# EasyEDA schematic rapoukChargingPCBv0.json
TITLE: rapoukChargingBoardv0; REV: 1.0; Date: 09-01-25; Sheet: 1/1; Drawn By: Roman Suk; Company: Suk Industries
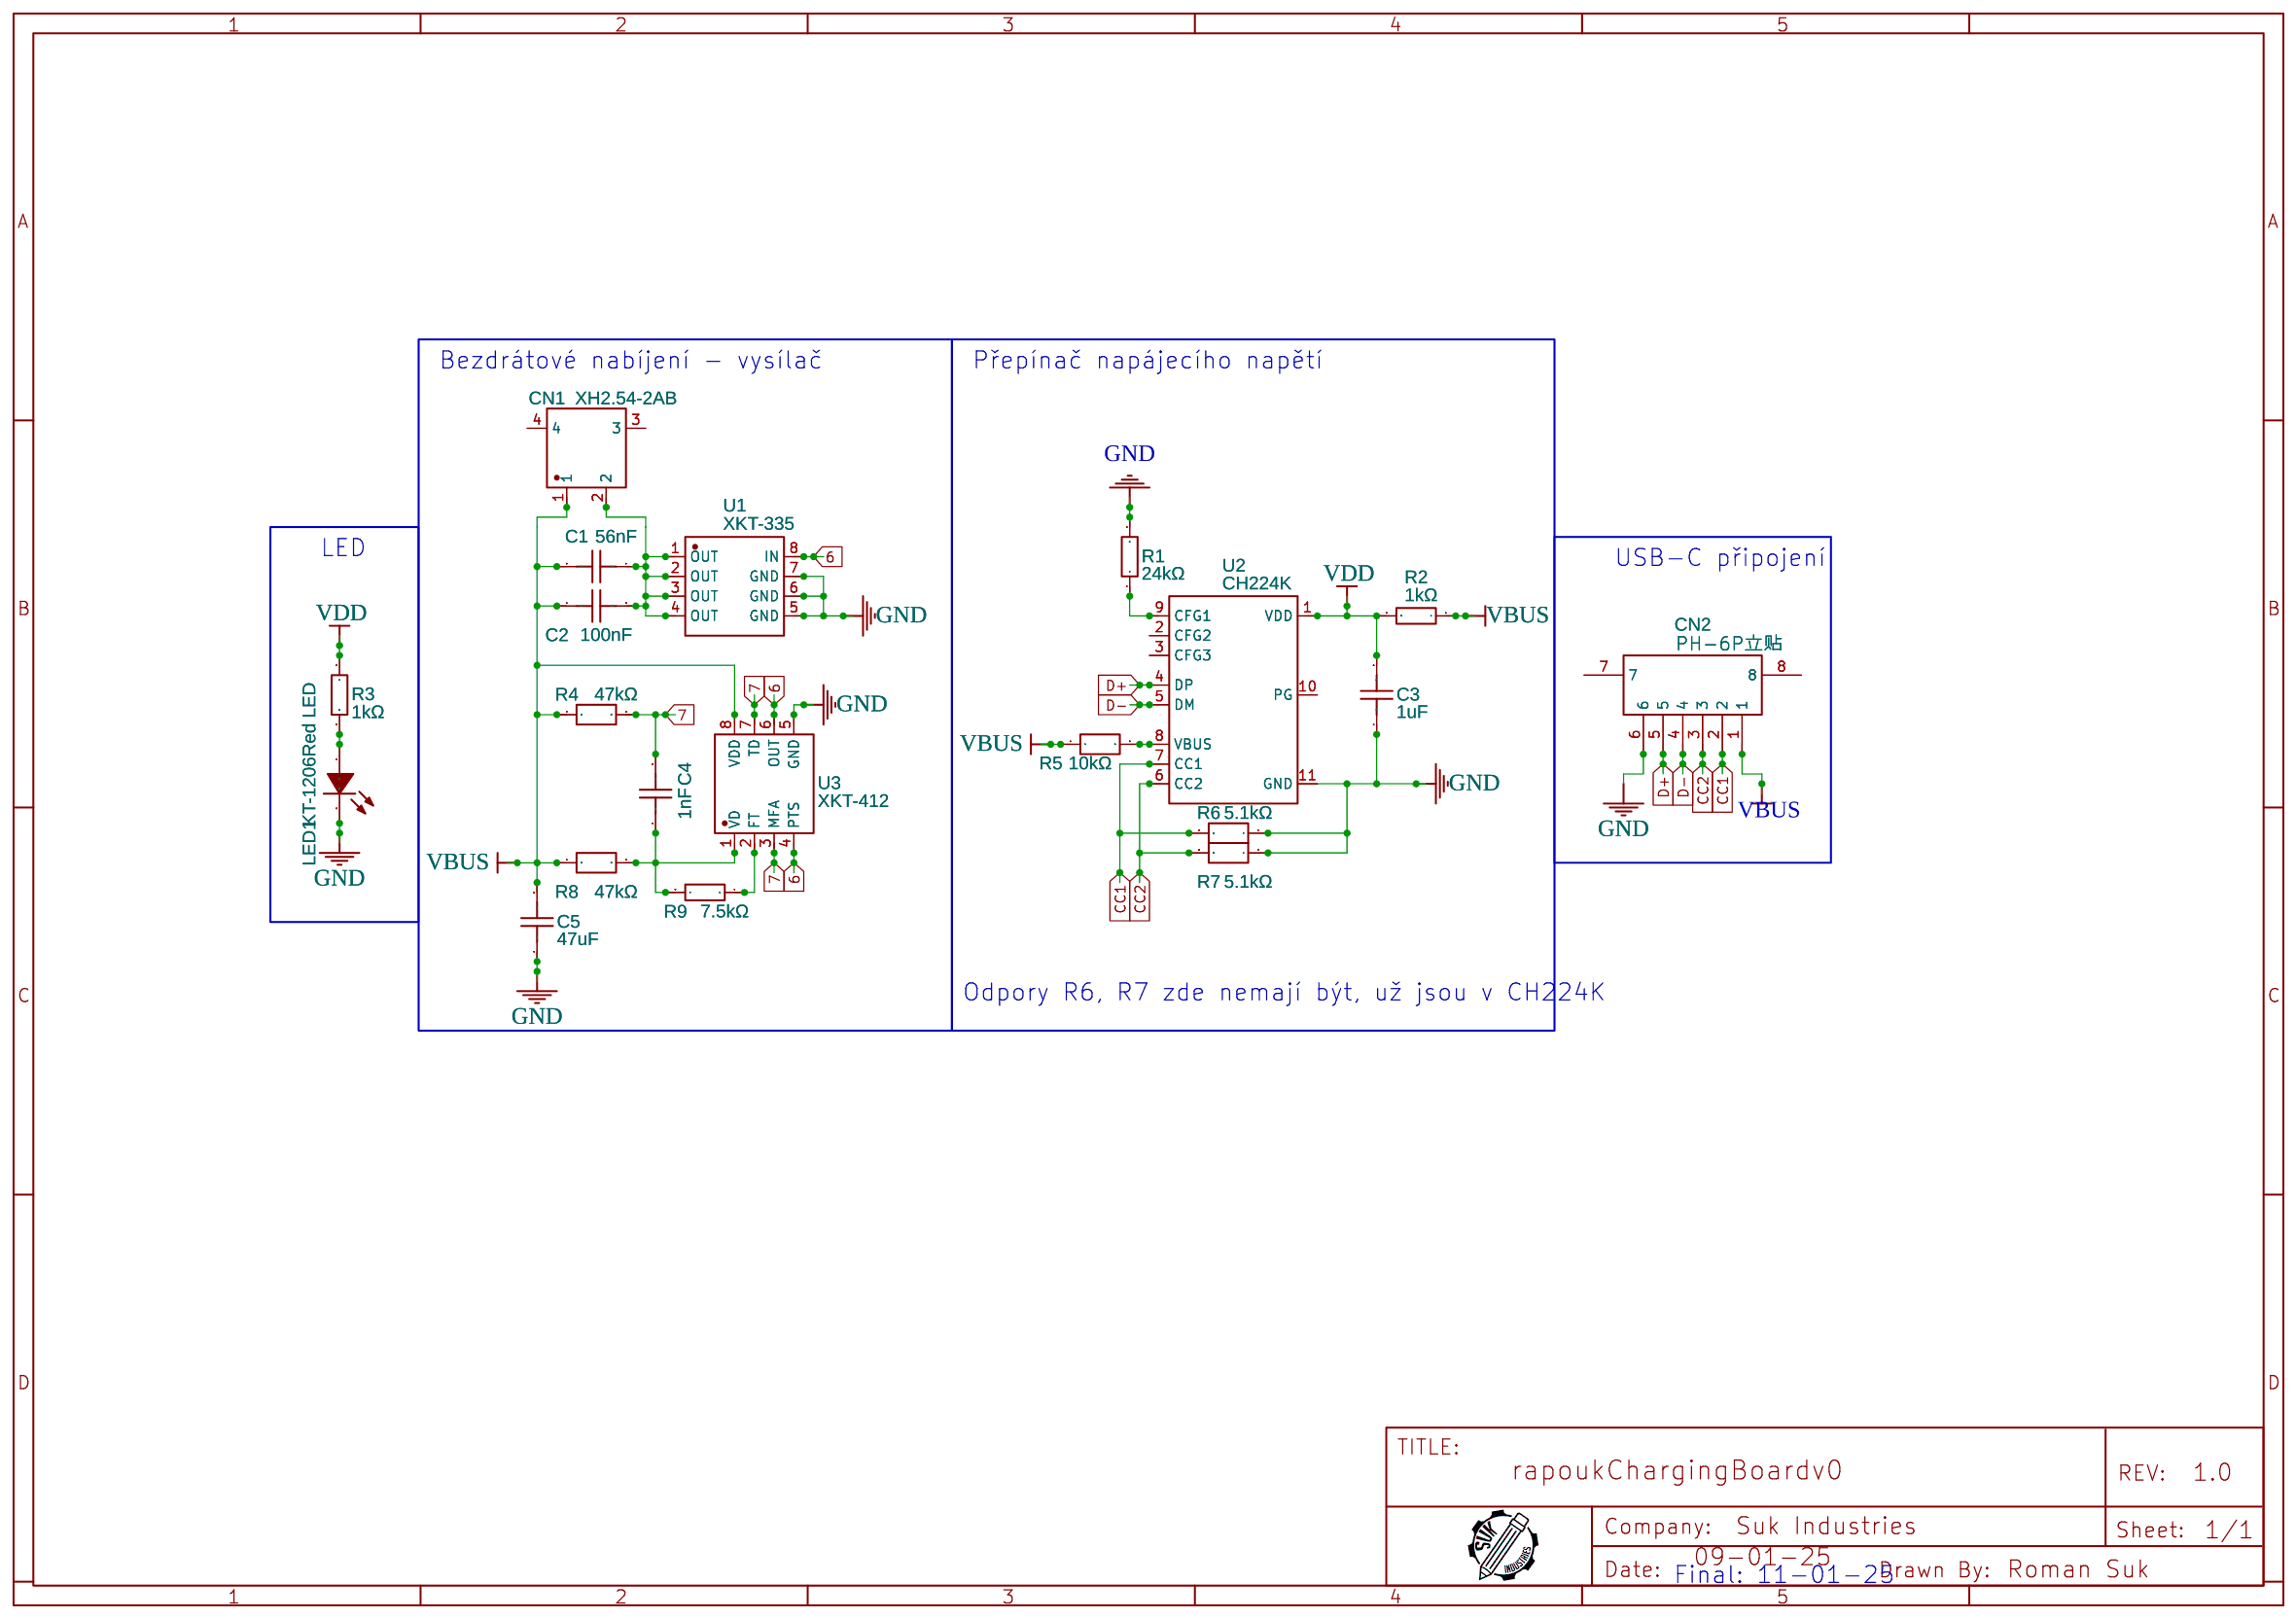
[diagram p0: schematic sheet]

## Parts
C1  56nF  [C1206]
C2  100nF  [C1206]
C3  1uF  [C1206]
C4  1nF  [C1206]
C5  47uF  [C1206]
CN1  XH2.54-2AB  [CONN-SMD_2P-P2.54_XH2.54-2AB]
CN2  PH-6P立贴  [CONN-SMD_6P-P2.0-L14.0-W5.4]
LED1  KT-1206Red LED  [LED1206-R-RD_RED]
R1  24kΩ  [R1206]
R2  1kΩ  [R1206]
R3  1kΩ  [R1206]
R4  47kΩ  [R1206]
R5  10kΩ  [R1206]
R6  5.1kΩ  [R0603]
R7  5.1kΩ  [R0603]
R8  47kΩ  [R1206]
R9  7.5kΩ  [R1206]
U1  XKT-335  [SOP-8_L5.0-W4.0-P1.27-LS6.0-BL]
U2  CH224K  [ESSOP-10_L4.9-W3.9-P1.0-LS6.0-TL-EP]
U3  XKT-412  [SOIC-8_L4.9-W3.9-P1.27-LS6.2-BL]

## Library data of the parts
C1 = TCC1206X7R563K500DT: Contributor: LCSC; Supplier: LCSC; Supplier Part: C282879; Manufacturer: CCTC(三环); JLCPCB Part Class: Extended Part
C2 = CL31B104KBCNNNL: Supplier: LCSC; Supplier Part: C3838922; Manufacturer: SAMSUNG(三星); JLCPCB Part Class: Extended Part; Contributor: lcsc
C3 = C1206X105K5RAC7800: Contributor: LCSC; Supplier: LCSC; Supplier Part: C141215; Manufacturer: KEMET(基美); JLCPCB Part Class: Extended Part
C4 = 500R18N102JV4T: Contributor: LCSC; Supplier: LCSC; Supplier Part: C431634; Manufacturer: JOHANSON(约翰逊); JLCPCB Part Class: Extended Part
C5 = LMK316ABJ476ML-T: Contributor: LCSC; Supplier: LCSC; Supplier Part: C268024; Manufacturer: TAIYO YUDEN(太诱); JLCPCB Part Class: Extended Part
CN1 = XH2.54-2AB: Contributor: LCSC; Supplier: LCSC; Supplier Part: C146125; Manufacturer: BOOMELE(博穆精密); Manufacturer Part: XH-2P立贴; JLCPCB Part Class: Extended Part
CN2 = PH-6P立贴: Contributor: LCSC; Supplier: LCSC; Supplier Part: C64659; Manufacturer: BOOMELE(博穆精密); JLCPCB Part Class: Extended Part
LED1 = KT-1206Red LED: Supplier: LCSC; Manufacturer: KENTO; Manufacturer Part: KT-1206R; Supplier Part: C49018; JLCPCB Part Class: Extended Part
R1 = AECR1206F24K0K9: Contributor: LCSC; Supplier: LCSC; Supplier Part: C352112; Manufacturer: RESI(开步睿思); JLCPCB Part Class: Extended Part
R2 R3 = CR1206-FX-1001ELF: Contributor: LCSC; Supplier: LCSC; Supplier Part: C205045; Manufacturer: BOURNS; JLCPCB Part Class: Extended Part
R4 R8 = CR1206J47K0P05Z: Contributor: LCSC; Supplier: LCSC; Supplier Part: C881279; Manufacturer: EVER OHMS(天二科技); JLCPCB Part Class: Extended Part
R5 = PTFR1206B10K0N9: Supplier: LCSC; Supplier Part: C2692764; Manufacturer: RESI(开步睿思); JLCPCB Part Class: Extended Part; Contributor: lcsc
R6 R7 = HOARG0603-1/10W-5.1KR-0.1%-TCR25: Supplier: LCSC; Supplier Part: C5123614; Manufacturer: Milliohm(毫欧); Manufacturer Part: HoARG0603-1/10W-5.1KR-0.1%-TCR25; JLCPCB Part Class: Extended Part; Contributor: lcsc
R9 = CR1206J40752G: Supplier: LCSC; Manufacturer: LIZ(丽智电子); Supplier Part: C102387; JLCPCB Part Class: Extended Part
U1 = XKT-335: Contributor: LCSC; Supplier: LCSC; Supplier Part: C2887877; Manufacturer: null; JLCPCB Part Class: Extended Part
U2 = CH224K: Contributor: lcsc; Supplier: LCSC; Supplier Part: C970725; Manufacturer: WCH(南京沁恒); JLCPCB Part Class: Extended Part
U3 = XKT-412: Contributor: lcsc; Supplier: LCSC; Supplier Part: C9900042544; Manufacturer: null

## Nets
GND: C3.1 C5.1 CN2.6 LED1.2(K) R1.2 R6.1 R7.1 U1.5(GND) U1.6(GND) U1.7(GND) U2.11(GND) U3.5(GND)
VBUS: C1.2 C2.1 C5.2 CN1.1 CN2.1 R2.1 R4.1 R5.1 R8.1 U3.8(VDD)
VDD: C3.2 R2.2 R3.1 U2.1(VDD)
6: U1.8(IN) U3.4(PTS) U3.6(OUT)
7: C4.2 R4.2 U3.3(MFA) U3.7(TD)
CC1: CN2.2 R6.2 U2.7(CC1)
CC2: CN2.3 R7.2 U2.6(CC2)
D+: CN2.5 U2.4(DP)
D-: CN2.4 U2.5(DM)
Net-(C1-1): C1.1 C2.2 CN1.2 U1.1(OUT) U1.2(OUT) U1.3(OUT) U1.4(OUT)
Net-(C4-1): C4.1 R8.2 R9.2 U3.1(VD)
Net-(LED1-1): LED1.1(A) R3.2
Net-(R1-1): R1.1 U2.9(CFG1)
Net-(R5-2): R5.2 U2.8(VBUS)
Net-(R9-1): R9.1 U3.2(FT)

Not connected (* = marked no-connect by the designer): CN1 3 4; CN2 7 8; U2 2(CFG2) 3(CFG3) 10(PG)

## Notes on the sheet
- Bezdrátové nabíjení - vysílač
- Přepínač napájecího napětí
- LED
- USB-C připojení
- Odpory R6, R7 zde nemají být, už jsou v CH224K
- Final: 11-01-25
